# EAGLE design main_4.1 (EAGLE 6.5.0)
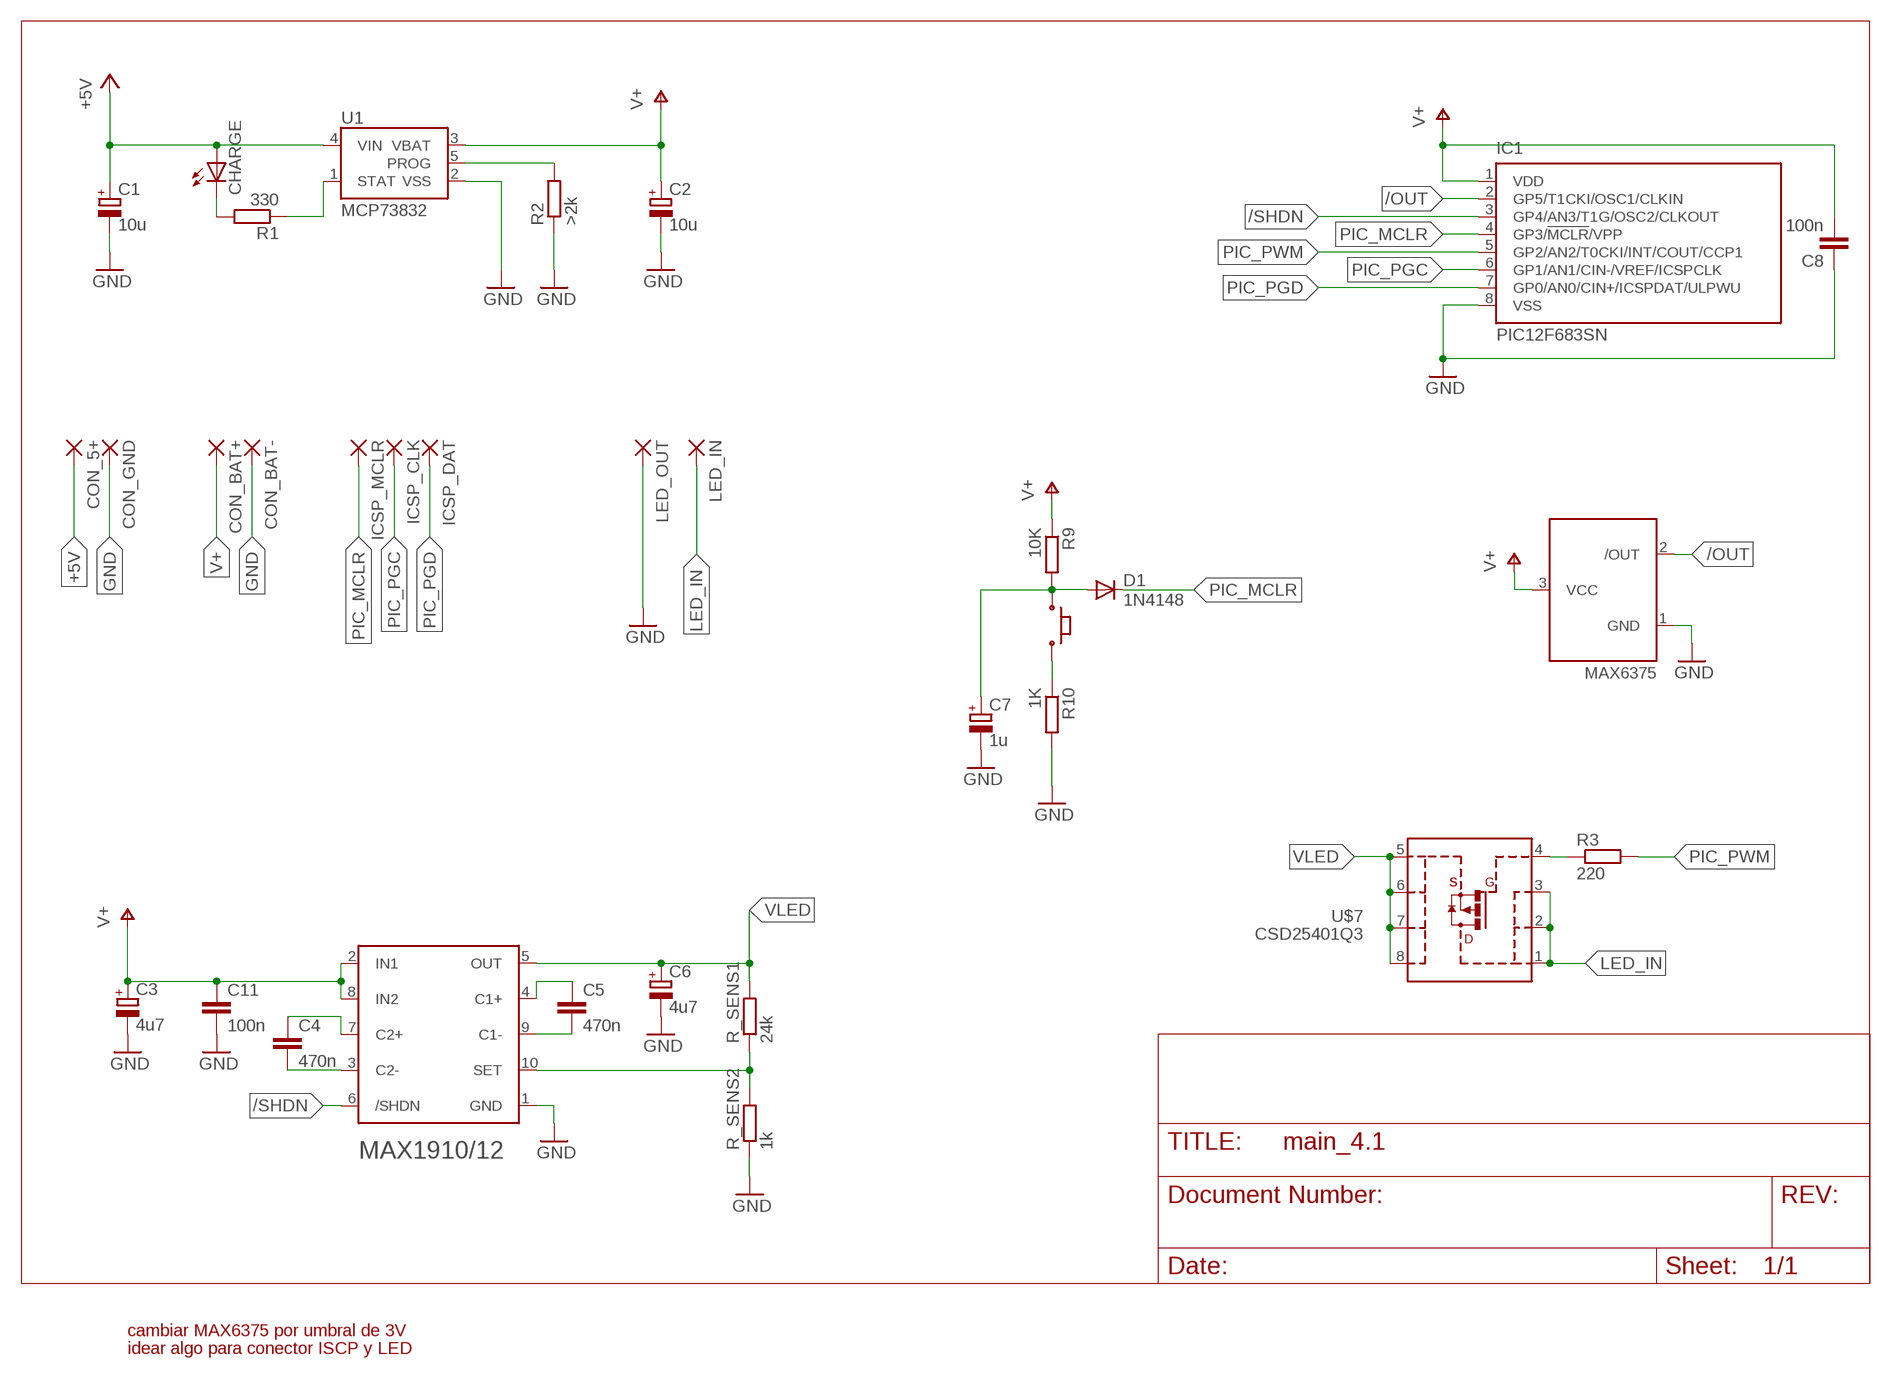
[diagram p0: schematic, sheet 1]

## Parts
C1  10u  CPOL-EUSMCA  [SMC_A]
C2  10u  CPOL-EUSMCA  [SMC_A]
C3  4u7  CPOL-EUSMCA  [SMC_A]
C4  470n  C-EUC1206  [C1206]
C5  470n  C-EUC1206  [C1206]
C6  4u7  CPOL-EUSMCA  [SMC_A]
C7  1u  CPOL-EUSMCA  [SMC_A]
C8  100n  C-EUC1206  [C1206]
C11  100n  C-EUC1206  [C1206]
CHARGE  LEDCHIPLED_1206  [CHIPLED_1206]
CON_5+  SMD5  [SMD2,54-5,08]
CON_BAT+  SMD5  [SMD2,54-5,08]
CON_BAT-  SMD5  [SMD2,54-5,08]
CON_GND  SMD5  [SMD2,54-5,08]
D1  1N4148  [SOD80]
IC1  PIC12F683SN  [SO-08]
ICSP_CLK  SMD5  [SMD2,54-5,08]
ICSP_DAT  SMD5  [SMD2,54-5,08]
ICSP_MCLR  SMD5  [SMD2,54-5,08]
LED_IN  SMD5  [SMD2,54-5,08]
LED_OUT  SMD5  [SMD2,54-5,08]
R1  330  R-EU_R1206  [R1206]
R2  >2k  R-EU_R1206  [R1206]
R3  220  R-EU_R1206  [R1206]
R9  10K  R-EU_R1206  [R1206]
R10  1K  R-EU_R1206  [R1206]
R_SENS1  24k  R-EU_R1206  [R1206]
R_SENS2  1k  R-EU_R1206  [R1206]
U1  MCP73832  [SOT23-5]
U$1  MAX1910/12  [UMAX/USOP_10L]
U$2  MAX6375  [SC70-3-W]
U$6  MICROBUTTONE-MERCHAN  [MICROBUTTON_2]
U$7  CSD25401Q3  [SON3X3]

## Nets
+5V: C1.+ CHARGE.A CON_5+.1(P) U1.4(VIN)
/OUT: IC1.2(GP5/T1CKI/OSC1/CLKIN) U$2.2(/OUT)
/SHDN: IC1.3(GP4/AN3/T1G/OSC2/CLKOUT) U$1.6(/SHDN)
BUT: C7.+ D1.1(A) R9.2 U$6.P$1
GND: C1.- C2.- C3.- C6.- C7.- C8.1 C11.2 CON_BAT-.1(P) CON_GND.1(P) IC1.8(VSS) LED_OUT.1(P) R2.1 R10.2 R_SENS2.1 U1.2(VSS) U$1.1(GND) U$2.1(GND)
LED_IN: LED_IN.1(P) U$7.1(D$1) U$7.2(D$2) U$7.3(D$3)
N$2: R_SENS1.1 R_SENS2.2 U$1.10(SET)
N$3: R2.2 U1.5(PROG)
N$4: R1.1 U1.1(STAT)
N$5: C4.2 U$1.3(C2-)
N$6: C4.1 U$1.7(C2+)
N$7: C5.2 U$1.9(C1-)
N$8: C5.1 U$1.4(C1+)
N$10: R10.1 U$6.P$2
N$13: R3.1 U$7.4(G$4)
N$15: CHARGE.C R1.2
PIC_MCLR: D1.2(C) IC1.4(GP3/!MCLR!/VPP) ICSP_MCLR.1(P)
PIC_PGC: IC1.6(GP1/AN1/CIN-/VREF/ICSPCLK) ICSP_CLK.1(P)
PIC_PGD: IC1.7(GP0/AN0/CIN+/ICSPDAT/ULPWU) ICSP_DAT.1(P)
PIC_PWM: IC1.5(GP2/AN2/T0CKI/INT/COUT/CCP1) R3.2
V+: C2.+ C3.+ C8.2 C11.1 CON_BAT+.1(P) IC1.1(VDD) R9.1 U1.3(VBAT) U$1.2(IN1) U$1.8(IN2) U$2.3(VCC)
VLED: C6.+ R_SENS1.2 U$1.5(OUT) U$7.5(S$5) U$7.6(S$6) U$7.7(S$7) U$7.8(S$8)

## Notes on the sheet
- cambiar MAX6375 por umbral de 3V
- idear algo para conector ISCP y LED

## Library data of the parts
C1-C3 C6 C7 = rcl:CPOL-EU: POLARIZED CAPACITOR, European symbol
C4 C5 C8 C11 = rcl:C-EU: CAPACITOR, European symbol
CHARGE = led:LED: LED OSRAM: - CHIPLED LG R971, LG N971, LY N971, LG Q971, LY Q971, LO R971, LY R971 LH N974, LH R974 LS Q976, LO Q976, LY Q976 LO Q996 - Hyper CHIPLED LW Q18S LB Q993, LB Q99A, LB R99A - SideLED LS A670, LO A670, LY A670, LG A670, LP A670 LB A673, LV A673, LT A673, LW A673 LH A674 LY A675 LS A676, LA A676, LO A676, LY A676, LW A676 LS A679, LY A679, LG A679 - Hyper Micro SIDELED® LS Y876, LA Y876, LO Y876, LY Y876 LT Y87S - SmartLED LW L88C, LW L88S LB L89C, LB L89S, LG L890 LS L89K, LO L89K, LY L89K LS L896, LA L896, LO L896, LY L896 - TOPLED LS T670, LO T670, LY T670, LG T670, LP T670 LSG T670, LSP T670, LSY T670, LOP T670, LYG T670 LG T671, LOG T671, LSG T671 LB T673, LV T673, LT T673, LW T673 LH T674 LS T676, LA T676, LO T676, LY T676, LB T676, LH T676, LSB T676, LW T676 LB T67C, LV T67C, LT T67C, LS T67K, LO T67K, LY T67K, LW E67C LS E67B, LA E67B, LO E67B, LY E67B, LB E67C, LV E67C, LT E67C LW T67C LS T679, LY T679, LG T679 LS T770, LO T770, LY T770, LG T770, LP T770 LB T773, LV T773, LT T773, LW T773 LH T774 LS E675, LA E675, LY E675, LS T675 LS T776, LA T776, LO T776, LY T776, LB T776 LHGB T686 LT T68C, LB T68C - Hyper Mini TOPLED® LB M676 - Mini TOPLED Santana® LG M470 LS M47K, LO M47K, LY M47K Source: http://www.osram.convergy.de LUXEON: - LUMILED® LXK2-PW12-R00, LXK2-PW12-S00, LXK2-PW14-U00, LXK2-PW14-V00 LXK2-PM12-R00, LXK2-PM12-S00, LXK2-PM14-U00 LXK2-PE12-Q00, LXK2-PE12-R00, LXK2-PE12-S00, LXK2-PE14-T00, LXK2-PE14-U00 LXK2-PB12-K00, LXK2-PB12-L00, LXK2-PB12-M00, LXK2-PB14-N00, LXK2-PB14-P00, LXK2-PB14-Q00 LXK2-PR12-L00, LXK2-PR12-M00, LXK2-PR14-Q00, LXK2-PR14-R00 LXK2-PD12-Q00, LXK2-PD12-R00, LXK2-PD12-S00 LXK2-PH12-R00, LXK2-PH12-S00 LXK2-PL12-P00, LXK2-PL12-Q00, LXK2-PL12-R00 Source: www.luxeon.com KINGBRIGHT: KA-3528ASYC Source: www.kingbright.com
CON_5+ CON_BAT+ CON_BAT- CON_GND ICSP_CLK ICSP_DAT ICSP_MCLR LED_IN LED_OUT = wirepad:SMD5: SMD PAD
D1 = dan:1N4148: DIODE high speed (Philips)
IC1 = microchip:PIC12F683: 8-Pin Flash-Based, 8-Bit CMOS Microcontrollers with nanoWatt Technology Source: http://ww1.microchip.com/downloads/en/DeviceDoc/41211D_.pdf; MF: MICROCHIP; MPN: PIC12F683-I/SN; OC_FARNELL: 9759042; OC_NEWARK: 61K3434
R1-R3 R9 R10 R_SENS1 R_SENS2 = rcl:R-EU_: RESISTOR, European symbol
U1 = dan:MCP73832: Microchip's MCP73832 Miniature single cell, fully integrated Li-Ion, Li-polymer charge management controller http://ww1.microchip.com/downloads/en/DeviceDoc/21984a.pdf
U$1 = dan:MAX1910/12: MAX1910/12 1.5X/2X High-Efficiency White LED Charge Pumps
U$2 = dan:MAX6375: MAX6375 3 pin, ultra-low-power sc70/sot23 voltage detectors
U$6 = dan:MICROBUTTON
U$7 = dan:CSD25401Q3

## Board
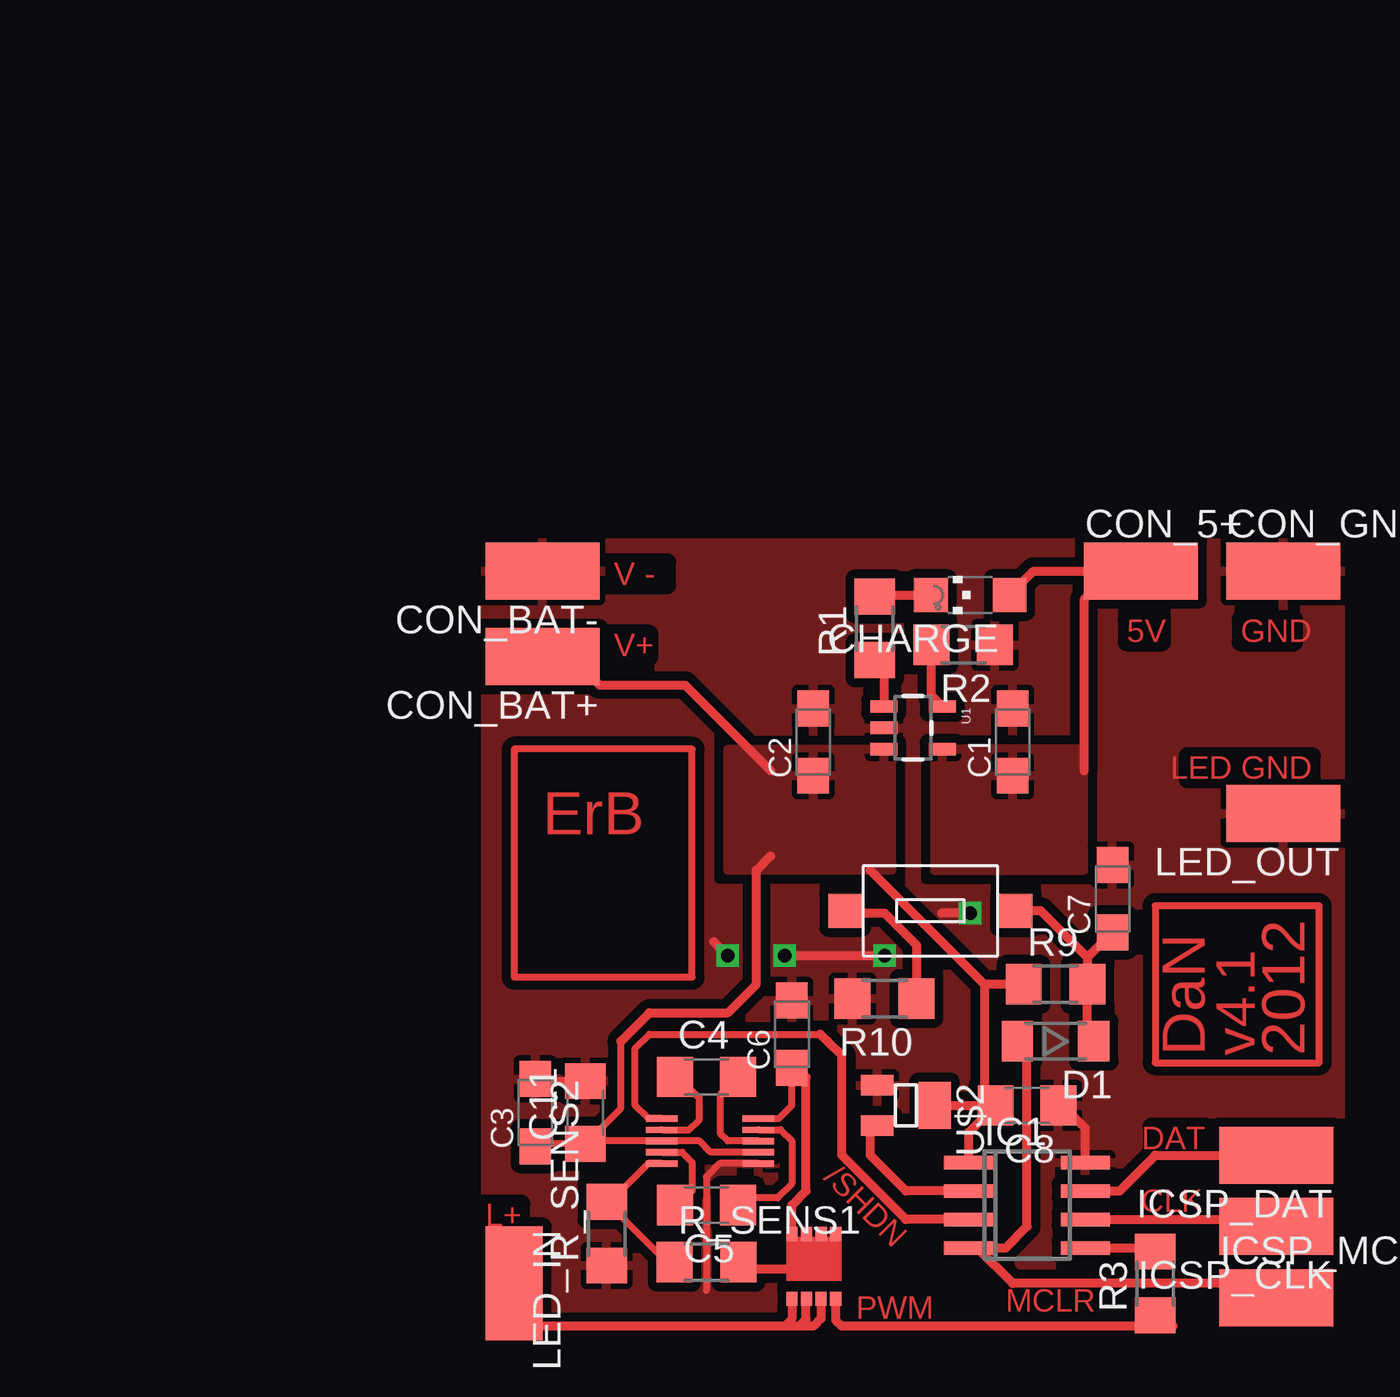
[diagram p1: board, top side]
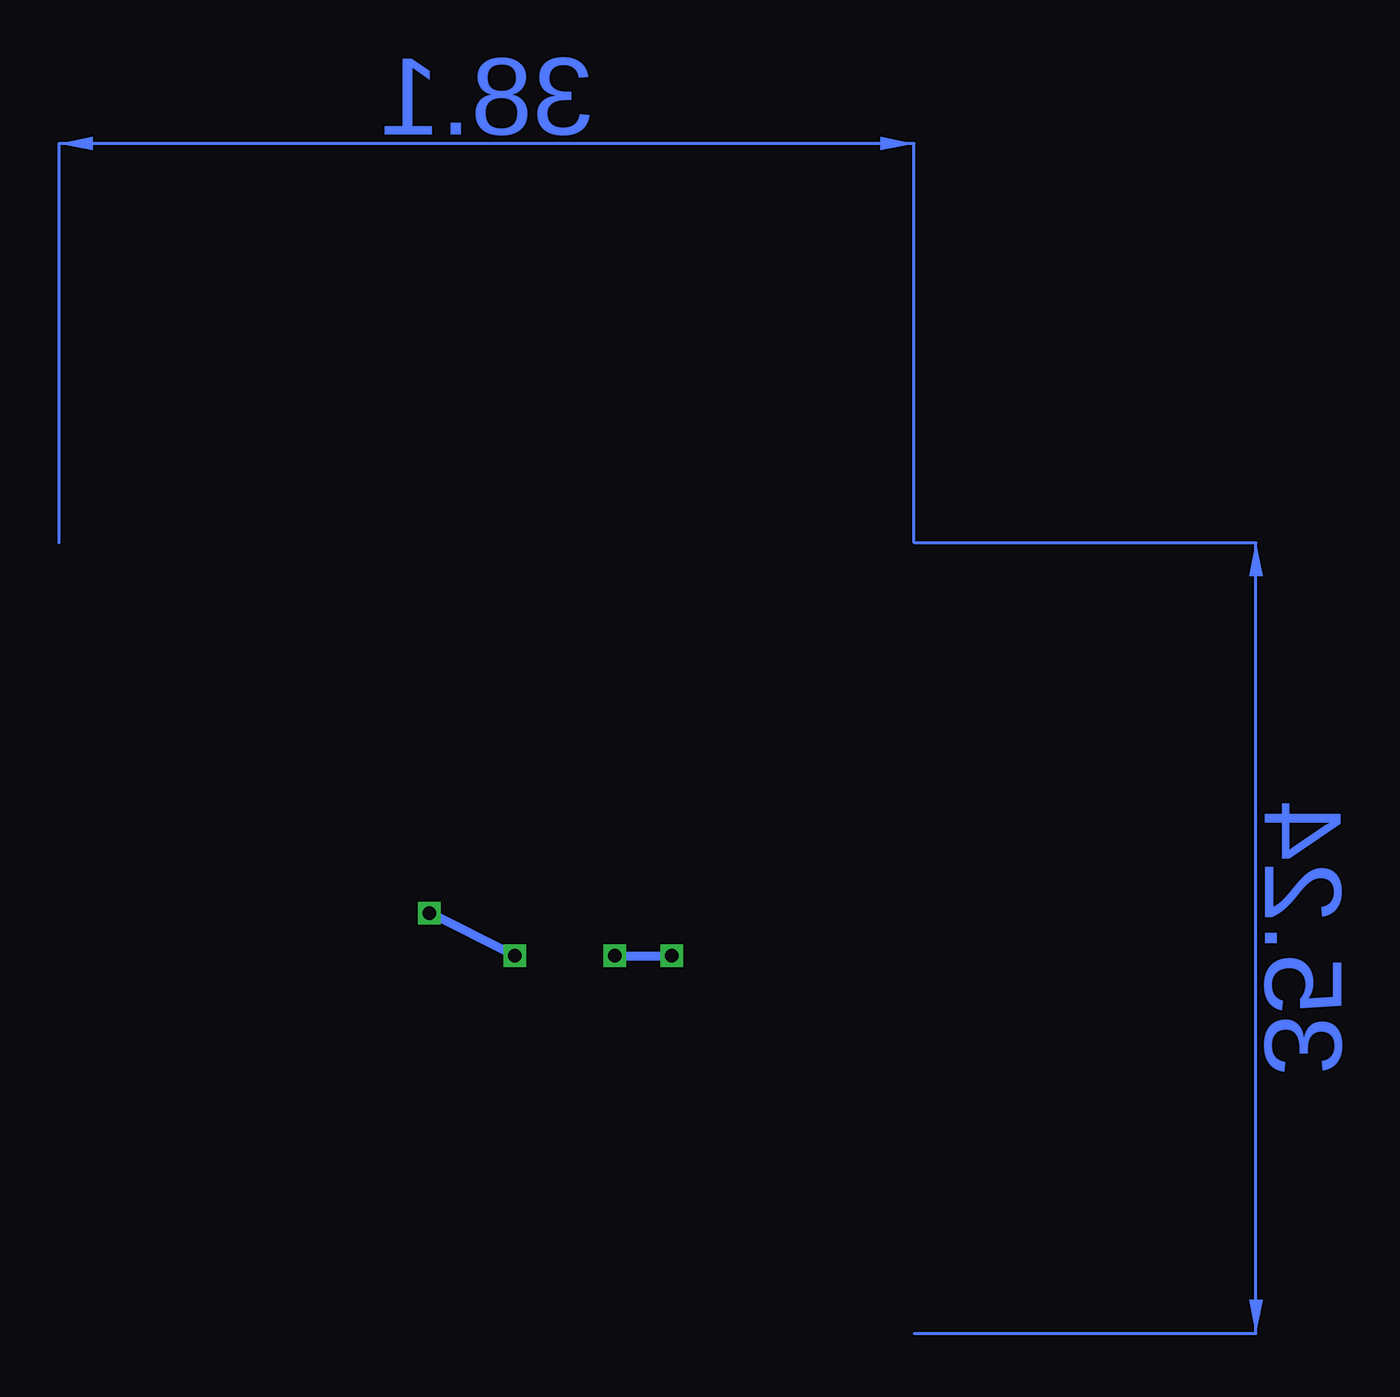
[diagram p2: board, bottom side, seen from below]

No outline drawn. Coordinates in mm, seen from the top.
Copper layers (1*16): Top 0.035mm / dielectric 1.5mm / Bottom 0.035mm
Design rules "default": minimum track width 10mil, minimum drill 24mil, track to track 16mil, track to pad 16mil, pad to pad 16mil, via to via 16mil, smd to smd 16mil, copper to edge 0mil, drill to drill 8mil, minimum pad ring 10mil, minimum via ring 8mil, stop-mask expansion 4mil, vias tented up to drill 0mil, thermal gap 10mil

### Footprints (pad centres in the part's own frame; a part is rotated, then mirrored left to right if it is on the bottom)
SMC_A = smd 1.6 x 1.4: + -1.5,0; - 1.5,0
C1206 = smd 1.6 x 1.8: 1 -1.4,0; 2 1.4,0
CHIPLED_1206 = smd 1.5 x 1.5: A 0,-1.75; C 0,1.75
SMD2,54-5,08 = smd 2.54 x 5.08: 1 0,0
SOD80 = smd 1.4 x 1.8: 1 -1.7,0; 2 1.7,0
SO-08 = smd 0.6 x 2.2: 1 -1.905,-2.6; 2 -0.635,-2.6; 3 0.635,-2.6; 4 1.905,-2.6; 5 1.905,2.6; 6 0.635,2.6; 7 -0.635,2.6; 8 -1.905,2.6
R1206 = smd 1.6 x 1.803: 1 -1.422,0; 2 1.422,0
SOT23-5 = smd 0.55 x 1.2: 1 -0.95,-1.3; 2 0,-1.3; 3 0.95,-1.3; 4 0.95,1.3; 5 -0.95,1.3
UMAX/USOP_10L = smd 1.4 x 0.28: 1 -2,1; 2 -2,0.5; 3 -2,0; 4 -2,-0.5; 5 -2,-1; 6 2.3,-1; 7 2.3,-0.5; 8 2.3,0; 9 2.3,0.5; 10 2.3,1
SC70-3-W = smd 0.9 x 1.45: 1 -0.9,-1.275; 2 0.9,-1.275 | smd 2.1 x 1.45: 3 0,1.275
MICROBUTTON_2 = smd 1.5 x 1.5: P$1 3.625,0.095; P$2 -3.975,0.095
SON3X3 = smd 0.63 x 0.5: 1 1.95,0; 2 1.95,0.65; 3 1.95,1.3; 4 1.95,1.95; 5 -0.936,1.95; 6 -0.936,1.3; 7 -0.936,0.65; 8 -0.936,0

### Placement (x,y rotation side)
C1  23.5,26.67 90 top
C2  14.61,26.67 90 top
C3  2.22,10.16 90 top
C4  9.84,11.75 0 top
C5  9.84,6.03 180 top
C6  13.65,13.65 90 top
C7  27.94,19.68 90 top
C8  24.13,10.48 180 top
C11  4.45,10.16 90 top
CHARGE  21.6,33.22 90 top
CON_5+  29.21,34.29 270 top
CON_BAT+  2.54,30.48 90 top
CON_BAT-  2.54,34.29 90 top
CON_GND  35.56,34.29 270 top
D1  25.4,13.34 180 top
IC1  24.13,6.03 270 top
ICSP_CLK  35.24,5.08 90 top
ICSP_DAT  35.24,8.26 90 top
ICSP_MCLR  35.24,1.91 270 top
LED_IN  1.27,2.54 180 top
LED_OUT  35.56,23.5 90 top
R1  17.35,31.74 90 top
R2  21.28,31 180 top
R3  29.84,2.54 90 top
R9  25.4,15.88 0 top
R10  17.78,15.24 180 top
R_SENS1  9.84,3.49 0 top
R_SENS2  5.4,4.76 90 top
U1  19.05,27.3 270 top
U$1  10.16,8.89 180 top
U$2  18.73,10.48 270 top
U$6  20,19.05 0 top
U$7  13.65,3.81 270 top

### Tracks (layer width: path | path; a pad name or v marks a point on that pad's centre or on a via)
+5V
  Top 0.406: CHARGE.A 24.42,34.29 CON_5+.1 27.94,34.29 26.67,33.02 26.67,25.4
  pour Top (isolate 0.406): 20,26.35 20,20.95 26.67,20.95 26.67,26.35
/OUT
  Top 0.305: 17.14,9.53 17.41,9.53 U$2.2
  Top 0.406: IC1.2 18.73,6.67 17.14,8.26 17.14,9.53 17.78,9.53
/SHDN
  Top 0.305: U$1.6 7.25,9.89 6.67,10.48 6.67,13.02 7.3,13.65 14.92,13.65
  Top 0.406: IC1.3 18.73,5.4 15.88,8.26 15.88,12.7 15.24,13.34 14.92,13.65
BUT
  Top 0.406: D1.1 26.82,13.61 R9.2 26.82,17.07 | C7.+ 26.82,17.07 | 26.82,17.07 24.74,19.14 U$6.P$1
GND  (via drill 0.6)
  Top 0.305: U$1.1 10.43,7.89 9.84,7.3 9.84,2.22 | C11.2 2.32,11.56 C3.- | 35.24,22.54 LED_OUT.1
  Top 0.406: IC1.8 26.73,9.46 25.4,10.79 | U$2.1 17.78,11.38 | v21.59,19.05 20.32,19.05 | v17.78,17.14 v13.34,17.14 | v10.79,17.14 10.16,17.78
  Bottom 0.406: v13.34,17.14 v10.79,17.14 | v17.78,17.14 v21.59,19.05
  pour Top (rank 6): 38.1,0.32 0,0.32 0,35.56 38.1,35.56
LED_IN
  Top 0.406: 13.97,0.64 13.34,0.64 | 13.34,0.64 1.27,0.64 LED_IN.1 | 13.97,0.64 14.29,0.95 14.29,1.91 14.3,1.91 U$7.2 | U$7.1 13.65,0.95 13.34,0.64 | U$7.3 14.95,0.98 14.61,0.64 13.97,0.64
N$2
  Top 0.305: 5.4,6.67 R_SENS2.2 8.09,3.49 R_SENS1.1 | U$1.10 7.25,7.89 5.71,6.35
  Top 0.406: 5.71,6.35 5.4,6.35 R_SENS2.2
N$3
  Top 0.406: U1.5 19.86,28.75 R2.2
N$4
  Top 0.406: R1.1 17.75,29.92 U1.1
N$5
  Top 0.305: U$1.3 10.79,8.89 10.48,9.21 10.48,10.98 C4.2
N$6
  Top 0.305: U$1.7 9.07,9.39 9.53,9.84 9.53,10.79 8.26,12.06 8.26,11.75 | C4.1 8.26,11.75 | 8.26,11.75 8.26,11.43
N$7
  Top 0.305: U$1.9 8.76,8.39 9.21,7.94 9.21,6.67 8.26,5.71
  Top 0.406: 8.26,5.71 8.44,5.71 C5.2
N$8
  Top 0.305: U$1.4 13.15,9.39 13.65,8.89 13.65,6.99 13.02,6.35 11.43,6.35
  Top 0.406: C5.1 11.43,6.03 11.43,6.35
N$9
  Top 0.305: 29.84,12.38 37.15,12.38 37.15,19.37 29.84,19.37 29.84,12.38
N$10
  Top 0.406: U$6.P$2 16.89,19.05 17.78,19.05 19.2,17.63 R10.1
N$13
  Top 0.406: R3.1 30.63,0.64 15.88,0.64 15.6,0.91 U$7.4
N$14
  Top 0.305: 1.27,16.19 9.21,16.19 9.21,26.35 1.27,26.35 1.27,16.19
N$15
  Top 0.406: R1.2 17.41,33.22 CHARGE.C
PIC_MCLR
  Top 0.406: ICSP_MCLR.1 35.56,2.54 23.5,2.54 21.91,4.13 IC1.4 23.18,4.13 24.13,5.08 24.13,13.34 D1.2 23.5,13.34
PIC_PGC
  Top 0.406: IC1.6 35.88,5.4 arc90 36.2,5.71 ICSP_CLK.1
PIC_PGD
  Top 0.406: 35.24,7.3 ICSP_DAT.1 29.84,8.26 28.26,6.67 IC1.7
PIC_PWM
  Top 0.406: IC1.5 29.53,4.13 29.84,3.81 R3.2
V+
  Top 0.305: U$1.2 10.03,8.39 9.53,8.89 U$1.8 4.58,8.89 arc90 C11.1 | C11.1 2.32,8.76 C3.+ | C11.1 6.03,10.35 6.03,13.34 | 22.71,10.31 22.56,10.31 22.32,10.07
  Top 0.406: IC1.1 21.53,9.28 22.32,10.07 C8.2 22.23,10.98 22.23,15.88 | 22.71,10.31 22.86,10.16 22.86,10.79 22.54,10.48 U$2.3 | R9.1 22.23,15.88 | 6.03,13.34 7.3,14.61 10.79,14.61 12.06,15.88 12.06,20.95 12.7,21.59 | 22.23,15.88 17.14,20.95 | CON_BAT+.1 3.81,30.48 5.08,29.21 8.89,29.21 12.7,25.4
  pour Top (isolate 0.406): 18.1,26.35 18.1,20.95 10.79,20.95 10.79,26.35
VLED
  Top 0.305: R_SENS1.2 11.58,3.81 11.88,3.51 | U$1.5 13.06,9.89 13.65,10.48 C6.+ | 13.65,11.75 C6.+ | 13.34,12.06 13.65,12.06 C6.+
  Top 0.406: U$7.5 15.6,4.17 14.95,3.52 | 14.95,3.52 14.61,3.17 13.97,3.17 | 13.97,3.17 11.58,3.17 R_SENS1.2 | U$7.6 14.95,3.52 | U$7.7 14.3,3.51 13.97,3.17 | 13.97,3.17 13.65,3.49 U$7.8 13.65,6.03 14.29,6.67 14.29,11.75 13.97,12.06 13.34,12.06
(copper drawn outside any net)
  shapes: Bottom area x2

### Text on the board
Top: V - | 5V | GND | V+ | LED GND | ErB | DaN | v4.1 | 2012 | DAT | /SHDN | CLK | L+ | PWM | MCLR